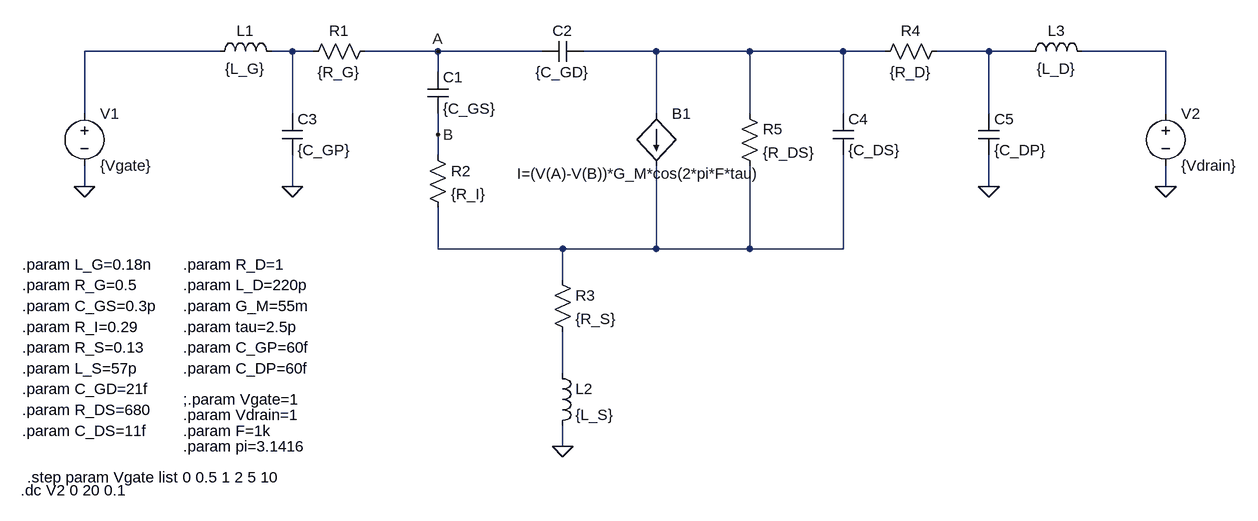
[diagram p0: schematic smallSignalTesting.asc]
smallSignalTesting.asc, the LTspice schematic file:
Version 4
SHEET 1 1540 708
WIRE -48 16 -256 16
WIRE 64 16 32 16
WIRE 96 16 64 16
WIRE 288 16 176 16
WIRE 448 16 288 16
WIRE 624 16 512 16
WIRE 768 16 624 16
WIRE 912 16 768 16
WIRE 976 16 912 16
WIRE 1136 16 1056 16
WIRE 1200 16 1136 16
WIRE 1408 16 1280 16
WIRE 288 48 288 16
WIRE -256 112 -256 16
WIRE 64 112 64 16
WIRE 624 112 624 16
WIRE 768 112 768 16
WIRE 912 112 912 16
WIRE 1136 112 1136 16
WIRE 1408 112 1408 16
WIRE 288 144 288 112
WIRE 288 176 288 144
WIRE -256 224 -256 192
WIRE 64 224 64 176
WIRE 1136 224 1136 176
WIRE 1408 224 1408 192
WIRE 288 320 288 256
WIRE 480 320 288 320
WIRE 624 320 624 192
WIRE 624 320 480 320
WIRE 768 320 768 192
WIRE 768 320 624 320
WIRE 912 320 912 176
WIRE 912 320 768 320
WIRE 480 368 480 320
WIRE 480 512 480 448
WIRE 480 624 480 592
FLAG 64 224 0
FLAG -256 224 0
FLAG 1136 224 0
FLAG 1408 224 0
FLAG 480 624 0
FLAG 288 16 A
FLAG 288 144 B
SYMBOL ind -64 32 R270
WINDOW 0 32 56 VTop 2
WINDOW 3 5 56 VBottom 2
SYMATTR InstName L1
SYMATTR Value {L_G}
SYMBOL res 192 0 R90
WINDOW 0 0 56 VBottom 2
WINDOW 3 32 56 VTop 2
SYMATTR InstName R1
SYMATTR Value {R_G}
SYMBOL res 272 160 R0
SYMATTR InstName R2
SYMATTR Value {R_I}
SYMBOL cap 272 48 R0
SYMATTR InstName C1
SYMATTR Value {C_GS}
SYMBOL cap 512 0 R90
WINDOW 0 0 32 VBottom 2
WINDOW 3 32 32 VTop 2
SYMATTR InstName C2
SYMATTR Value {C_GD}
SYMBOL res 464 352 R0
SYMATTR InstName R3
SYMATTR Value {R_S}
SYMBOL ind 464 496 R0
SYMATTR InstName L2
SYMATTR Value {L_S}
SYMBOL cap 48 112 R0
SYMATTR InstName C3
SYMATTR Value {C_GP}
SYMBOL voltage -256 96 R0
WINDOW 123 0 0 Left 0
WINDOW 39 0 0 Left 0
SYMATTR InstName V1
SYMATTR Value {Vgate}
SYMBOL bi 624 112 R0
WINDOW 3 -214 92 Left 2
SYMATTR InstName B1
SYMATTR Value I=(V(A)-V(B))*G_M*cos(2*pi*F*tau)
SYMBOL res 752 96 R0
SYMATTR InstName R5
SYMATTR Value {R_DS}
SYMBOL cap 896 112 R0
SYMATTR InstName C4
SYMATTR Value {C_DS}
SYMBOL res 1072 0 R90
WINDOW 0 0 56 VBottom 2
WINDOW 3 32 56 VTop 2
SYMATTR InstName R4
SYMATTR Value {R_D}
SYMBOL cap 1120 112 R0
SYMATTR InstName C5
SYMATTR Value {C_DP}
SYMBOL ind 1184 32 R270
WINDOW 0 32 56 VTop 2
WINDOW 3 5 56 VBottom 2
SYMATTR InstName L3
SYMATTR Value {L_D}
SYMBOL voltage 1408 96 R0
WINDOW 123 0 0 Left 0
WINDOW 39 0 0 Left 0
SYMATTR InstName V2
SYMATTR Value {Vdrain}
TEXT -352 344 Left 2 !.param L_G=0.18n
TEXT -352 376 Left 2 !.param R_G=0.5
TEXT -352 408 Left 2 !.param C_GS=0.3p
TEXT -352 440 Left 2 !.param R_I=0.29
TEXT -352 472 Left 2 !.param R_S=0.13
TEXT -352 504 Left 2 !.param L_S=57p
TEXT -352 536 Left 2 !.param C_GD=21f
TEXT -352 568 Left 2 !.param R_DS=680
TEXT -352 600 Left 2 !.param C_DS=11f
TEXT -104 344 Left 2 !.param R_D=1
TEXT -104 376 Left 2 !.param L_D=220p
TEXT -104 408 Left 2 !.param G_M=55m
TEXT -104 440 Left 2 !.param tau=2.5p
TEXT -104 472 Left 2 !.param C_GP=60f
TEXT -104 504 Left 2 !.param C_DP=60f
TEXT -104 552 Left 2 !;.param Vgate=1
TEXT -104 576 Left 2 !.param Vdrain=1
TEXT -104 600 Left 2 !.param F=1k
TEXT -104 624 Left 2 !.param pi=3.1416
TEXT -344 672 Left 2 !.step param Vgate list 0 0.5 1 2 5 10
TEXT -354 692 Left 2 !.dc V2 0 20 0.1

The netlist it stands for:
* smallSignalTesting.asc
L1 N001 N002 {L_G}
R1 A N002 {R_G}
R2 B N006 {R_I}
C1 A B {C_GS}
C2 N003 A {C_GD}
R3 N006 N007 {R_S}
L2 N007 0 {L_S}
C3 N002 0 {C_GP}
V1 N001 0 {Vgate}
B1 N003 N006 I=(V(A)-V(B))*G_M*cos(2*pi*F*tau)
R5 N003 N006 {R_DS}
C4 N003 N006 {C_DS}
R4 N004 N003 {R_D}
C5 N004 0 {C_DP}
L3 N004 N005 {L_D}
V2 N005 0 {Vdrain}
.param L_G=0.18n
.param R_G=0.5
.param C_GS=0.3p
.param R_I=0.29
.param R_S=0.13
.param L_S=57p
.param C_GD=21f
.param R_DS=680
.param C_DS=11f
.param R_D=1
.param L_D=220p
.param G_M=55m
.param tau=2.5p
.param C_GP=60f
.param C_DP=60f
;.param Vgate=1
.param Vdrain=1
.param F=1k
.param pi=3.1416
.step param Vgate list 0 0.5 1 2 5 10
.dc V2 0 20 0.1
.backanno
.end

* Results of the author's LTspice run, read from the files saved beside the schematic
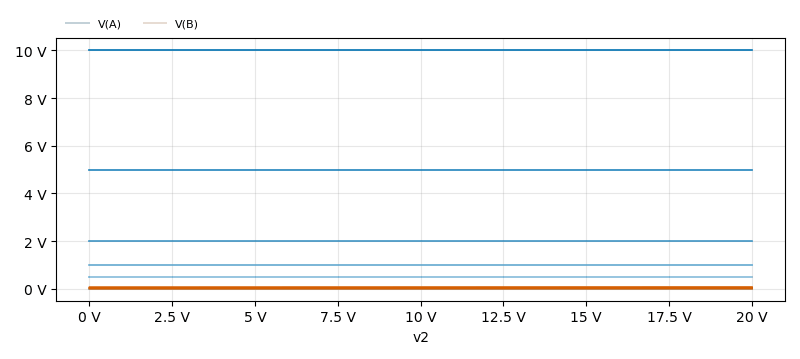
[diagram p1: DC transfer characteristic of smallSignalTesting.asc, plotted from the saved traces]
* DC transfer characteristic, 6 runs:
*   V(A) [run 1]: 0 V at v2=0 V, 2.107e-10 fV at v2=20 V, min 0 V, max 2.107e-10 fV
*   V(A) [run 2]: 500 mV at v2=0 V, 500 mV at v2=20 V, min 500 mV, max 500 mV
*   V(A) [run 3]: 1 V at v2=0 V, 1 V at v2=20 V, min 1 V, max 1 V
*   V(A) [run 4]: 2 V at v2=0 V, 2 V at v2=20 V, min 2 V, max 2 V
*   V(A) [run 5]: 5 V at v2=0 V, 5 V at v2=20 V, min 5 V, max 5 V
*   V(A) [run 6]: 10 V at v2=0 V, 10 V at v2=20 V, min 10 V, max 10 V
*   V(B) [run 1]: 0 V at v2=0 V, 3.819 mV at v2=20 V, min 0 V, max 3.819 mV
*   V(B) [run 2]: 3.571 mV at v2=0 V, 7.39 mV at v2=20 V, min 3.571 mV, max 7.39 mV
*   V(B) [run 3]: 7.142 mV at v2=0 V, 10.96 mV at v2=20 V, min 7.142 mV, max 10.96 mV
*   V(B) [run 4]: 14.28 mV at v2=0 V, 18.1 mV at v2=20 V, min 14.28 mV, max 18.1 mV
*   V(B) [run 5]: 35.71 mV at v2=0 V, 39.53 mV at v2=20 V, min 35.71 mV, max 39.53 mV
*   V(B) [run 6]: 71.42 mV at v2=0 V, 75.24 mV at v2=20 V, min 71.42 mV, max 75.24 mV